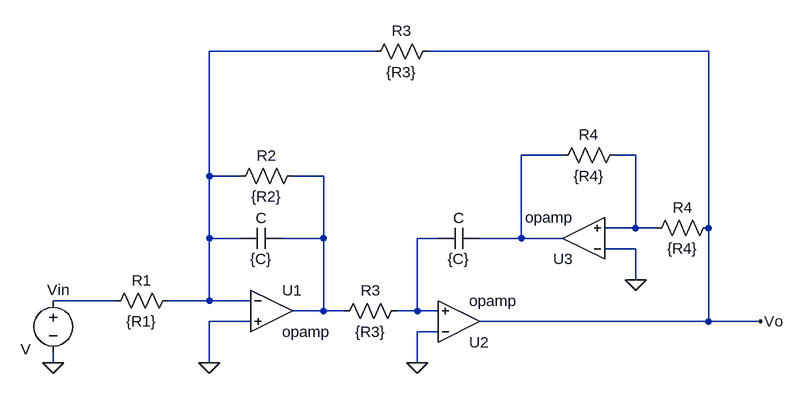
[diagram p0: schematic Draft1.asc]
Draft1.asc, the LTspice schematic file:
Version 4
SHEET 1 880 680
WIRE 176 64 -80 64
WIRE 688 64 256 64
WIRE 464 224 400 224
WIRE 576 224 544 224
WIRE -80 256 -80 64
WIRE -32 256 -80 256
WIRE 96 256 48 256
WIRE 576 336 576 224
WIRE 576 336 528 336
WIRE 608 336 576 336
WIRE 688 336 688 64
WIRE -80 352 -80 256
WIRE -32 352 -80 352
WIRE 96 352 96 256
WIRE 96 352 32 352
WIRE 272 352 240 352
WIRE 400 352 400 224
WIRE 400 352 336 352
WIRE 464 352 400 352
WIRE 576 368 528 368
WIRE 576 416 576 368
WIRE -224 448 -320 448
WIRE -80 448 -80 352
WIRE -80 448 -144 448
WIRE -16 448 -80 448
WIRE 96 464 96 352
WIRE 96 464 48 464
WIRE 128 464 96 464
WIRE 240 464 240 352
WIRE 240 464 208 464
WIRE 272 464 240 464
WIRE -16 480 -80 480
WIRE 688 480 688 336
WIRE 688 480 336 480
WIRE 768 480 688 480
WIRE 272 496 240 496
WIRE -320 544 -320 528
WIRE -80 544 -80 480
WIRE 240 544 240 496
FLAG -80 544 0
FLAG 240 544 0
FLAG 576 416 0
FLAG 768 480 Vo
FLAG -320 544 0
SYMBOL OpAmps\\opamp 16 400 R0
SYMATTR InstName U1
SYMBOL OpAmps\\opamp 304 544 M180
SYMATTR InstName U2
SYMBOL OpAmps\\opamp 496 416 R180
SYMATTR InstName U3
SYMBOL res -128 432 R90
WINDOW 0 0 56 VBottom 2
WINDOW 3 32 56 VTop 2
SYMATTR InstName R1
SYMATTR Value {R1}
SYMBOL res 64 240 R90
WINDOW 0 0 56 VBottom 2
WINDOW 3 32 56 VTop 2
SYMATTR InstName R2
SYMATTR Value {R2}
SYMBOL res 224 448 R90
WINDOW 0 0 56 VBottom 2
WINDOW 3 32 56 VTop 2
SYMATTR InstName R3
SYMATTR Value {R3}
SYMBOL res 704 320 R90
WINDOW 0 0 56 VBottom 2
WINDOW 3 32 56 VTop 2
SYMATTR InstName R4
SYMATTR Value {R4}
SYMBOL res 560 208 R90
WINDOW 0 0 56 VBottom 2
WINDOW 3 32 56 VTop 2
SYMATTR InstName R4
SYMATTR Value {R4}
SYMBOL res 272 48 R90
WINDOW 0 0 56 VBottom 2
WINDOW 3 32 56 VTop 2
SYMATTR InstName R3
SYMATTR Value {R3}
SYMBOL cap 32 336 R90
WINDOW 0 0 32 VBottom 2
WINDOW 3 32 32 VTop 2
SYMATTR InstName C
SYMATTR Value {C}
SYMBOL cap 336 336 R90
WINDOW 0 0 32 VBottom 2
WINDOW 3 32 32 VTop 2
SYMATTR InstName C
SYMATTR Value {C}
SYMBOL voltage -320 432 R0
WINDOW 0 -9 -1 Left 2
WINDOW 3 -50 91 Left 2
SYMATTR InstName Vin

The netlist it stands for:
* Draft1.asc
XU1 N001 0 N004 opamp Aol=100K GBW=10Meg  ; pins invin noninvin out
XU2 0 N005 Vo opamp Aol=100K GBW=10Meg  ; pins invin noninvin out
XU3 0 N003 N002 opamp Aol=100K GBW=10Meg  ; pins invin noninvin out
R1 N001 N006 {R1}
R2 N004 N001 {R2}
R3 N005 N004 {R3}
R4 Vo N003 {R4}
R4 N003 N002 {R4}
R3 Vo N001 {R3}
C N004 N001 {C}
C N002 N005 {C}
Vin N006 0 V
.backanno
.end